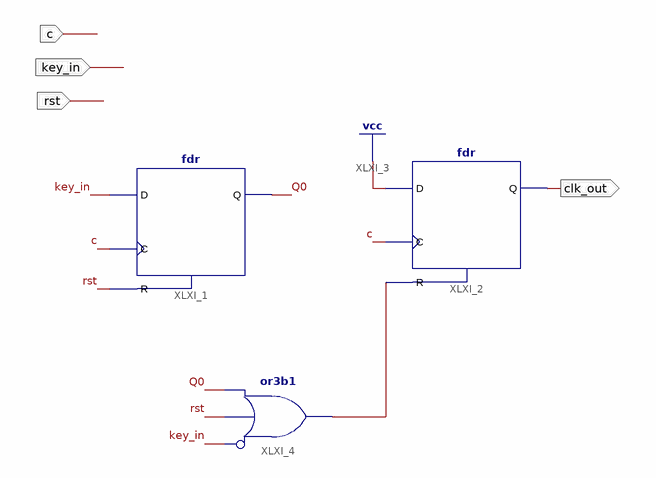
[diagram p0: schematic sheet 1]
// Xilinx ISE schematic Pulse.sch (spartan3e) as structural Verilog: 3 symbols, 4 ports
module Pulse (
  input  c,
  input  rst,
  input  key_in,
  output clk_out
);

  wire Q0, XLXN_18;

  fdr XLXI_1 (.C(c), .D(key_in), .R(rst), .Q(Q0));
  fdr XLXI_2 (.C(c), .D(1'b1), .R(XLXN_18), .Q(clk_out));
  or XLXI_4 (XLXN_18, ~key_in, rst, Q0);  // or3b1
endmodule
